# Altium schematic sheet user.SchDoc
size A; PageSetup: Record=PageOptions|CenterHorizontal=True|CenterVertical=True|PrintScale=1.12|XCorrection=1.00|YCorrection=1.00|PrintKind=0|BorderSize=5000000|LeftOffset=0|BottomOffset=0|Orientation=2|PaperLength=1000|PaperWidth=1000|Scale=100|PaperSource=7|PrintQuality=-3|MediaType=1|DitherType=10|PrintScaleMode=1|PaperKind=Letter|PaperIndex=1
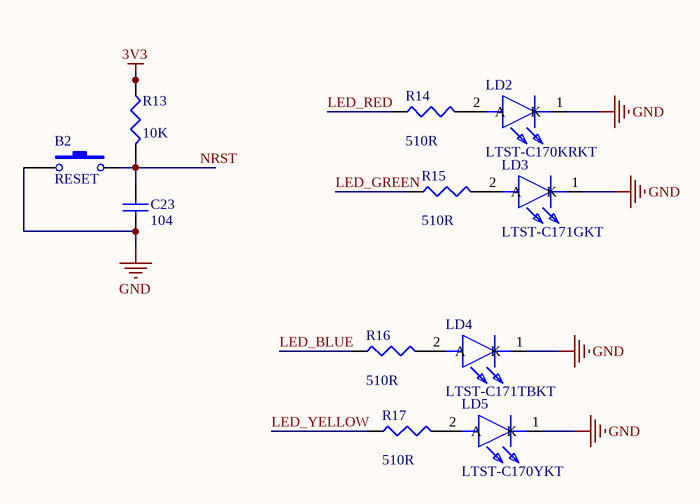
[diagram p0: user.SchDoc]

## Parts
B2  RESET  [3-1825910-5]
C23  104  [CAPC2012X98N]
LD2  LTST-C170KRKT  [LEDC2012X120N]
LD3  LTST-C171GKT  [LEDC2012X90N]
LD4  LTST-C171TBKT  [LEDC2012X90N]
LD5  LTST-C170YKT  [LEDC2012X120N]
R13  value 10K  [RESC2012X60N]
R14  value 510R  [RESC1608X55N]
R15  value 510R  [RESC1608X55N]
R16  value 510R  [RESC1608X55N]
R17  value 510R  [RESC1608X55N]

## Nets
3V3: R13.1
GND: B2.1 C23.2 LD2.1(K) LD3.1(K) LD4.1(K) LD5.1(K)
LED_BLUE: R16.1
LED_GREEN: R15.1
LED_RED: R14.1
LED_YELLOW: R17.1
NRST: B2.2 C23.1 R13.2
NetLD2_2: LD2.2(A) R14.2
NetLD3_2: LD3.2(A) R15.2
NetLD4_2: LD4.2(A) R16.2
NetLD5_2: LD5.2(A) R17.2

## Library data of the parts
B2 = SW-PB: Switch; Published: 24-Mar-1999; LatestRevisionDate: 17-Jul-2002; LatestRevisionNote: Re-released for DXP Platform.; PackageReference: SPST-2; Publisher: Altium Limited; PackageDescription: Switch; 2 Leads
C23 = Cap Semi: Capacitor (Semiconductor SIM Model); LatestRevisionDate: 17-Jul-2002; LatestRevisionNote: Re-released for DXP Platform.; PackageReference: C1206; Publisher: Altium Limited; Value: 104
LD2-LD5 = LTST-C171GKT: LED; Manufacturer_Name: Lite-On; Datasheet Link: https://media.digikey.com/pdf/Data%20Sheets/Lite-On%20PDFs/LTST-C171GKT.pdf; Height: 0.9mm; Manufacturer_Part_Number: LTST-C171GKT; Mouser Part Number: 859-LTST-C171GKT; Mouser Price/Stock: https://www.mouser.com/Search/Refine.aspx?Keyword=859-LTST-C171GKT; RS Part Number: 6920935P; RS Price/Stock: http://uk.rs-online.com/web/p/products/6920935P
R13-R17 = Res3: Resistor; Published: 8-Jun-2000; LatestRevisionDate: 29-May-2009; LatestRevisionNote: IPC-7351 Footprint Added.; PackageReference: J1-0603; Publisher: Altium Limited; PackageDescription: Chip Resistor